# EAGLE design TapuinoNext-Micro (EAGLE 9.6.2)
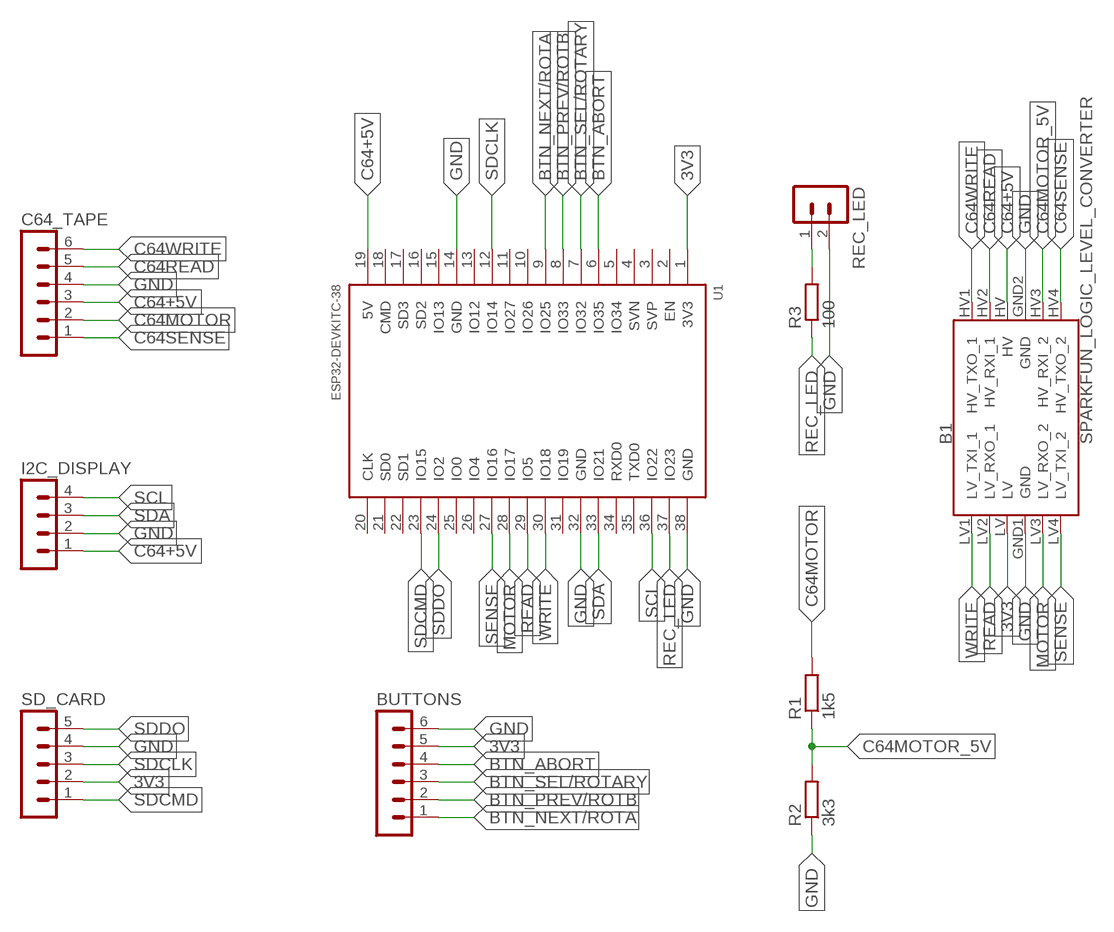
[diagram p0: schematic, sheet 1]

## Parts
B1  SPARKFUN_LOGIC_LEVEL_CONVERTER  [SPARKFUN_LOGIC_LEVEL_CONVERTER]
BUTTONS  MA06-1  [MA06-1]
C64_TAPE  MA06-1  [MA06-1]
I2C_DISPLAY  MA04-1  [MA04-1]
R1  1k5  R-EU_M0805  [M0805]
R2  3k3  R-EU_M0805  [M0805]
R3  100  R-EU_M0805  [M0805]
REC_LED  MA02-1  [MA02-1]
SD_CARD  MA05-1  [MA05-1]
U1  ESP32-DEVKITC-38  [ESP32-DEVKITC-38]

## Nets
3V3: B1.LV BUTTONS.5 SD_CARD.2 U1.1(3V3)
BTN_ABORT: BUTTONS.4 U1.6(IO35)
BTN_NEXT/ROTA: BUTTONS.1 U1.9(IO25)
BTN_PREV/ROTB: BUTTONS.2 U1.8(IO33)
BTN_SEL/ROTARY: BUTTONS.3 U1.7(IO32)
C64+5V: B1.HV C64_TAPE.3 I2C_DISPLAY.1 U1.19(5V)
C64MOTOR: C64_TAPE.2 R1.2
C64MOTOR_5V: B1.HV3(HV_RXI_2) R1.1 R2.2
C64READ: B1.HV2(HV_RXI_1) C64_TAPE.5
C64SENSE: B1.HV4(HV_TXO_2) C64_TAPE.1
C64WRITE: B1.HV1(HV_TXO_1) C64_TAPE.6
GND: B1.GND1(GND) B1.GND2(GND) BUTTONS.6 C64_TAPE.4 I2C_DISPLAY.2 R2.1 REC_LED.2 SD_CARD.4 U1.14(GND) U1.32(GND) U1.38(GND)
MOTOR: B1.LV3(LV_RXO_2) U1.28(IO17)
N$1: R3.2 REC_LED.1
READ: B1.LV2(LV_RXO_1) U1.29(IO5)
REC_LED: R3.1 U1.37(IO23)
SCL: I2C_DISPLAY.4 U1.36(IO22)
SDA: I2C_DISPLAY.3 U1.33(IO21)
SDCLK: SD_CARD.3 U1.12(IO14)
SDCMD: SD_CARD.1 U1.23(IO15)
SDDO: SD_CARD.5 U1.24(IO2)
SENSE: B1.LV4(LV_TXI_2) U1.27(IO16)
WRITE: B1.LV1(LV_TXI_1) U1.30(IO18)
Unconnected: U1.2(EN) U1.3(SVP) U1.4(SVN) U1.5(IO34) U1.10(IO26) U1.11(IO27) U1.13(IO12) U1.15(IO13) U1.16(SD2) U1.17(SD3) U1.18(CMD) U1.20(CLK) U1.21(SD0) U1.22(SD1) U1.25(IO0) U1.26(IO4) U1.31(IO19) U1.34(RXD0) U1.35(TXD0)

## Library data of the parts
B1 = SparkFun-Boards:SPARKFUN_LOGIC_LEVEL_CONVERTER: SparkFun Logic Level Converter -Bi-Directional This is the mechnical outline for the 3.3V - 5V bi directional logic level converter. *Note, the "LOCK" Package has the header pins staggered by an offset of 5 mils (off center line), so that when you slide a row of standard 0.1" headers into the PTH pads, it will hold position vertically. See the follwing turorial for more information on this type of special footprints: Sneaky Footprints <https://www.sparkfun.com/tutorials/114> SparkFun Products: SparkFun Logic Level Converter - Bi-Directional <https://www.sparkfun.com/products/12009>
BUTTONS C64_TAPE = con-lstb:MA06-1: PIN HEADER; OC_FARNELL: unknown; OC_NEWARK: unknown
I2C_DISPLAY = con-lstb:MA04-1: PIN HEADER; OC_FARNELL: unknown; OC_NEWARK: unknown
R1-R3 = rcl:R-EU_: RESISTOR, European symbol; SPICEPREFIX: R
REC_LED = con-lstb-ext:MA02-1: PIN HEADER; OC_FARNELL: unknown; OC_NEWARK: unknown
SD_CARD = con-lstb:MA05-1: PIN HEADER; OC_FARNELL: unknown; OC_NEWARK: unknown
U1 = ESP32-DEVKITC-38PIN:ESP32-DEVKITC-38: General Dev Kit Board For Esp-Wroom-32. This is the wider 38 pin version for which there was no accurate footprint available on the net.; AUTHOR: SWEETLILMRE

## Board
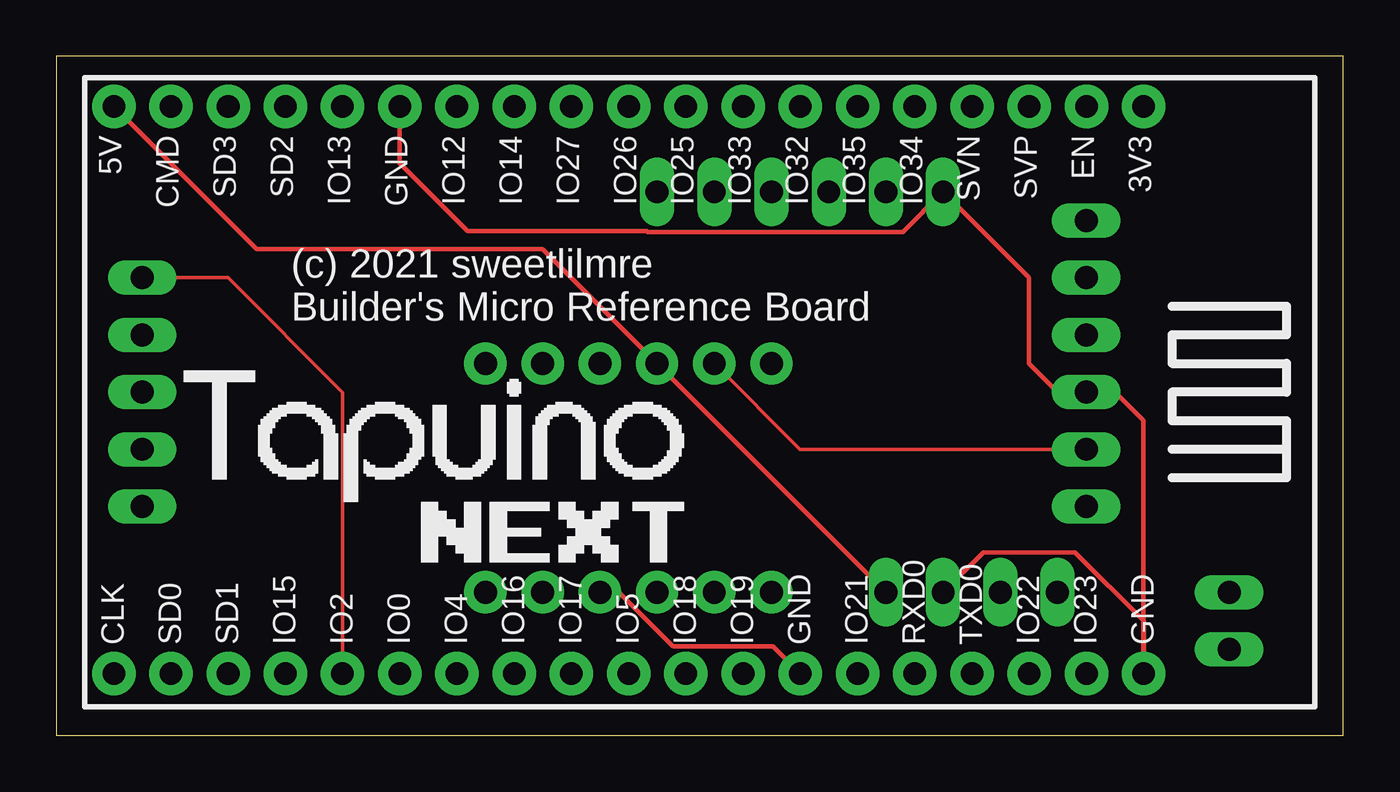
[diagram p1: board, top side]
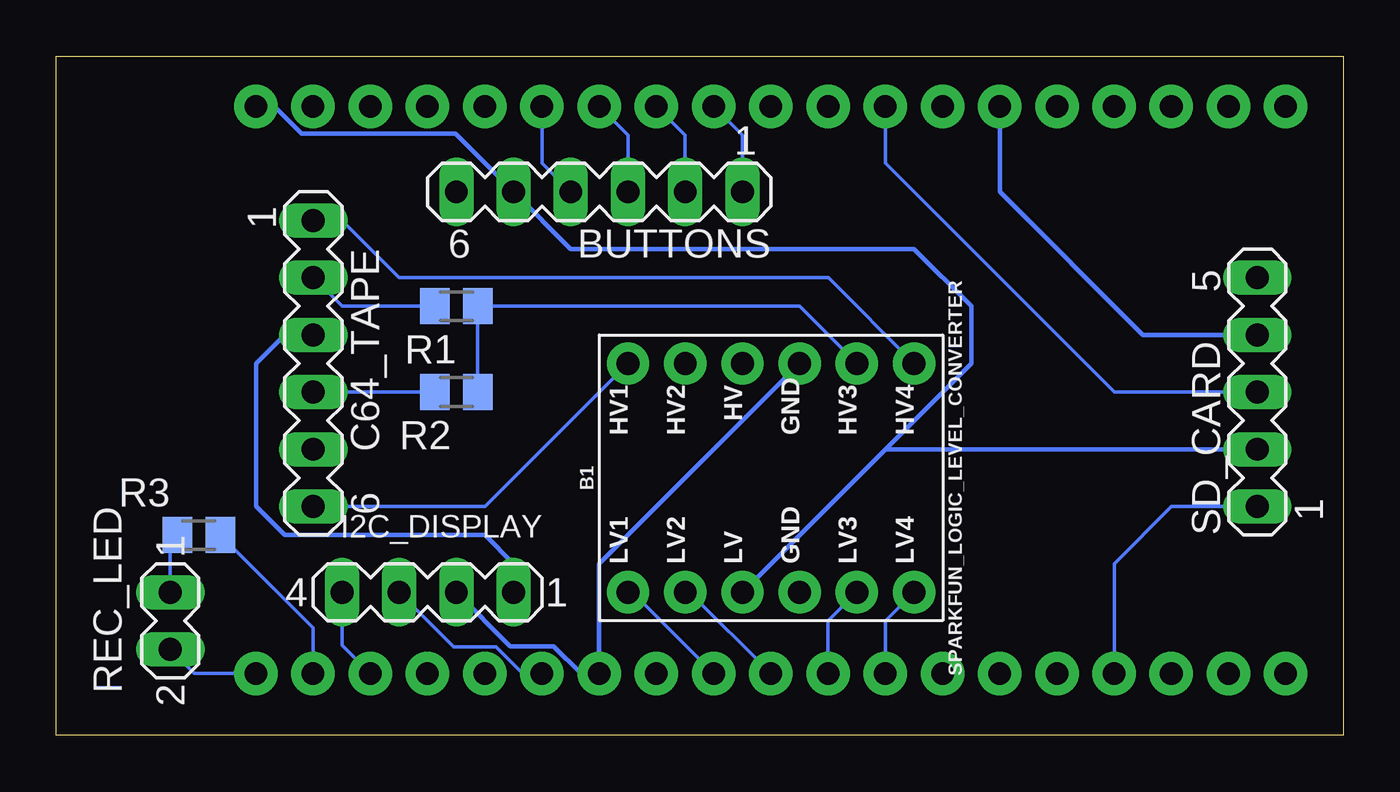
[diagram p2: board, bottom side, seen from below]

Size 57.13 x 30.15 mm. Coordinates in mm from the lower left corner, seen from the top.
Outline: 0,0 57.13,0 57.13,30.15 0,30.15 0,0
Copper layers (1*16): Top 0.035mm / dielectric 1.5mm / Bottom 0.035mm
Design rules "default": minimum track width 6mil, minimum drill 0.35mm, track to track 6mil, track to pad 6mil, pad to pad 6mil, via to via 6mil, smd to smd 6mil, copper to edge 40mil, drill to drill 6mil, minimum pad ring 10mil, minimum via ring 8mil, stop-mask expansion 4mil, vias tented up to drill 0mil, thermal gap 10mil

### Footprints (pad centres in the part's own frame; a part is rotated, then mirrored left to right if it is on the bottom)
SPARKFUN_LOGIC_LEVEL_CONVERTER = drill 1.016 pad 1.88: GND1 -5.08,-1.27; GND2 5.08,-1.27; HV 5.08,1.27; HV1 5.08,6.35; HV2 5.08,3.81; HV3 5.08,-3.81; HV4 5.08,-6.35; LV -5.08,1.27; LV1 -5.08,6.35; LV2 -5.08,3.81; LV3 -5.08,-3.81; LV4 -5.08,-6.35
MA06-1 = drill 1.016 long: 1 -6.35,0; 2 -3.81,0; 3 -1.27,0; 4 1.27,0; 5 3.81,0; 6 6.35,0
MA04-1 = drill 1.016 long: 1 -3.81,0; 2 -1.27,0; 3 1.27,0; 4 3.81,0
M0805 = smd 1.3 x 1.6: 1 -0.95,0; 2 0.95,0
MA02-1 = drill 1.016 long: 1 -1.27,0; 2 1.27,0
MA05-1 = drill 1.016 long: 1 -5.08,0; 2 -2.54,0; 3 0,0; 4 2.54,0; 5 5.08,0
ESP32-DEVKITC-38 = drill 1 pad 1.93: 1 12.69,-20.33; 2 12.69,-17.79; 3 12.69,-15.25; 4 12.69,-12.71; 5 12.69,-10.17; 6 12.69,-7.63; 7 12.69,-5.09; 8 12.69,-2.55; 9 12.69,-0.01; 10 12.69,2.53; 11 12.69,5.07; 12 12.69,7.61; 13 12.69,10.15; 14 12.69,12.69; 15 12.69,15.23; 16 12.69,17.77; 17 12.69,20.31; 18 12.69,22.85; 19 12.69,25.39; 20 -12.5,25.39; 21 -12.5,22.85; 22 -12.5,20.31; 23 -12.5,17.77; 24 -12.5,15.23; 25 -12.5,12.69; 26 -12.5,10.15; 27 -12.5,7.61; 28 -12.5,5.07; 29 -12.5,2.53; 30 -12.5,-0.01; 31 -12.5,-2.55; 32 -12.5,-5.09; 33 -12.5,-7.63; 34 -12.5,-10.17; 35 -12.5,-12.71; 36 -12.5,-15.25; 37 -12.5,-17.79; 38 -12.5,-20.33

### Placement (x,y rotation side)
B1  25.4,11.43 90 bottom
BUTTONS  33.02,24.13 180 bottom
C64_TAPE  45.72,16.51 270 bottom
I2C_DISPLAY  40.64,6.35 180 bottom
R1  39.37,19.05 180 bottom
R2  39.37,15.24 0 bottom
R3  50.8,8.89 180 bottom
REC_LED  52.07,5.08 270 bottom
SD_CARD  3.81,15.24 90 bottom
U1  27.94,15.24 90 top

### Tracks (layer width: path | path; a pad name or v marks a point on that pad's centre or on a via)
3V3
  Bottom 0.203: U1.1 47.45,27.93 46.24,26.71 39.41,26.71 BUTTONS.5 34.29,21.59 19.05,21.59 16.51,19.05 16.51,16.51 20.32,12.7 | 20.32,12.7 B1.LV | SD_CARD.2 20.32,12.7
BTN_ABORT
  Bottom 0.152: U1.6 35.57,25.41 BUTTONS.4
BTN_NEXT/ROTA
  Bottom 0.152: BUTTONS.1 26.67,26.65 U1.9
BTN_PREV/ROTB
  Bottom 0.152: U1.8 29.21,26.65 BUTTONS.2
BTN_SEL/ROTARY
  Bottom 0.152: U1.7 31.75,26.65 BUTTONS.3
C64+5V
  Top 0.203: I2C_DISPLAY.1 B1.HV 21.59,21.59 8.89,21.59 U1.19
  Bottom 0.203: I2C_DISPLAY.1 36.83,7.62 38.1,8.89 46.99,8.89 48.26,10.16 48.26,16.51 46.99,17.78 C64_TAPE.3
C64MOTOR
  Bottom 0.152: C64_TAPE.2 44.45,19.05 R1.2
C64MOTOR_5V
  Bottom 0.152: B1.HV3 24.13,19.05 R1.1 R2.2
C64READ
  Top 0.152: B1.HV2 33.02,12.7 C64_TAPE.5
C64SENSE
  Bottom 0.152: C64_TAPE.1 44.45,22.86 41.91,20.32 22.86,20.32 B1.HV4
C64WRITE
  Bottom 0.152: B1.HV1 38.1,10.16 C64_TAPE.6
GND
  Top 0.152: 20.8,22.38 21.59,22.38
  Top 0.203: I2C_DISPLAY.2 41.15,8.13 45.21,8.13 48.27,5.07 U1.38 48.26,13.97 46.99,15.24 C64_TAPE.4 44.45,15.24 43.18,16.51 43.18,20.32 BUTTONS.6 37.59,22.35 26.25,22.35 26.22,22.38 21.59,22.38 18.26,22.38 15.24,25.4 15.25,25.41 U1.14 | B1.GND1 24.98,6.35 27.37,3.96 31.81,3.96 U1.32
  Bottom 0.152: C64_TAPE.4 R2.1 | U1.38 51,2.74 REC_LED.2
  Bottom 0.203: I2C_DISPLAY.2 36.98,3.96 35.06,3.96 33.85,2.74 U1.32 33.03,7.61 B1.GND2 | U1.14 15.25,24.14 8.89,17.78 SD_CARD.4
MOTOR
  Bottom 0.152: B1.LV3 22.87,5.07 U1.28
N$1
  Bottom 0.152: R3.2 52.07,8.57 REC_LED.1
READ
  Bottom 0.152: U1.29 29.02,6.35 B1.LV2
REC_LED
  Bottom 0.152: 46.58,2.74 U1.37 45.73,4.77 R3.1
SCL
  Bottom 0.152: U1.36 44.45,4 I2C_DISPLAY.4
SDA
  Bottom 0.152: U1.33 36.42,2.74 37.62,3.93 39.49,3.93 I2C_DISPLAY.3
SDCLK
  Bottom 0.152: SD_CARD.3 7.62,15.24 7.64,15.24 10.16,15.24 20.33,25.41 U1.12
SDCMD
  Bottom 0.152: SD_CARD.1 7.62,10.16 10.17,7.61 U1.23
SDDO
  Top 0.152: SD_CARD.5 7.62,20.32 12.71,15.23 U1.24
SENSE
  Bottom 0.152: U1.27 20.33,5.07 B1.LV4
WRITE
  Bottom 0.152: U1.30 31.56,6.35 B1.LV1

### Text on the board
tPlace: (c) 2021 sweetlilmre / Builder's Micro Reference Board